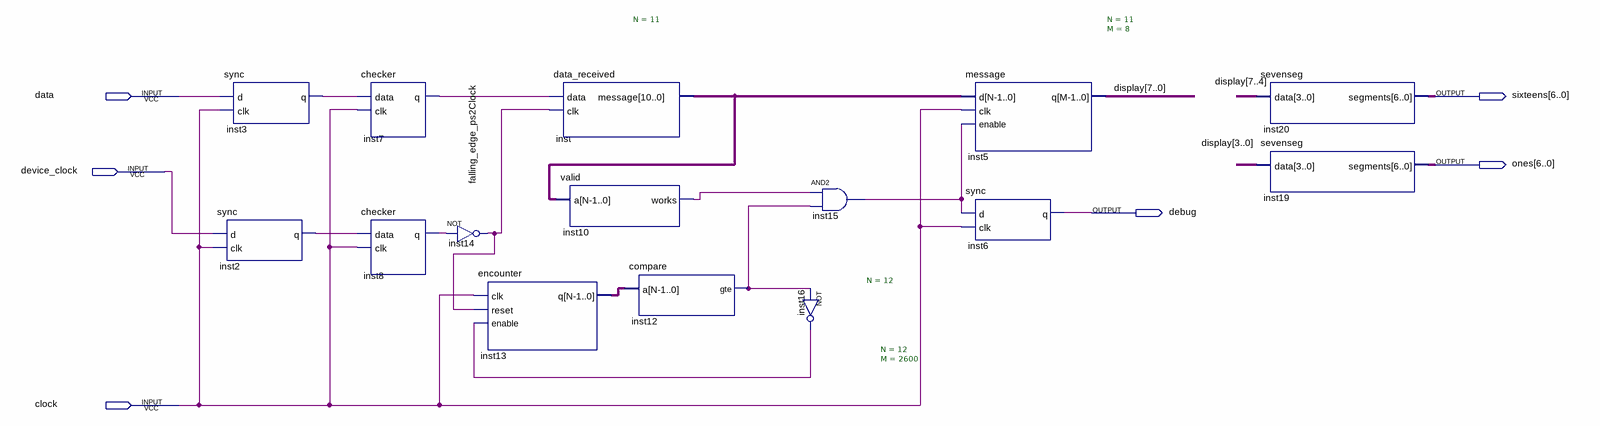
[diagram p0: schematic sheet]
// Quartus schematic PS_2.bdf as structural Verilog: 15 symbols, 6 pins
module PS_2 (
  input  data,
  input  device_clock,
  input  clock,
  output [6:0] sixteens,
  output [6:0] ones,
  output debug
);

  wire falling_edge_ps2Clock, inst2_q, inst3_q, inst7_q, inst8_q, inst10_works, inst12_gte, inst15_out,
       inst16_out;
  wire [7:0] display;
  wire [10:0] inst_message;
  wire [11:0] inst13_q;

  sync inst3 (.d(data), .clk(clock), .q(inst3_q));
  sync inst2 (.d(device_clock), .clk(clock), .q(inst2_q));
  \checker  inst7 (.data(inst3_q), .clk(clock), .q(inst7_q));
  \checker  inst8 (.data(inst2_q), .clk(clock), .q(inst8_q));
  not inst14 (falling_edge_ps2Clock, inst8_q);
  encounter #(.N(12)) inst13 (.clk(clock), .reset(falling_edge_ps2Clock), .enable(inst16_out), .q(inst13_q));
  data_received inst (.data(inst7_q), .clk(falling_edge_ps2Clock), .message(inst_message));
  valid #(.N(11)) inst10 (.a(inst_message), .works(inst10_works));
  compare #(.N(12), .M(2600)) inst12 (.a(inst13_q), .gte(inst12_gte));
  and inst15 (inst15_out, inst10_works, inst12_gte);
  not inst16 (inst16_out, inst12_gte);
  message #(.N(11), .M(8)) inst5 (.d(inst_message), .clk(clock), .enable(inst15_out), .q(display));
  sync inst6 (.d(inst15_out), .clk(clock), .q(debug));
  sevenseg inst20 (.data(display[7:4]), .segments(sixteens));
  sevenseg inst19 (.data(display[3:0]), .segments(ones));
endmodule
